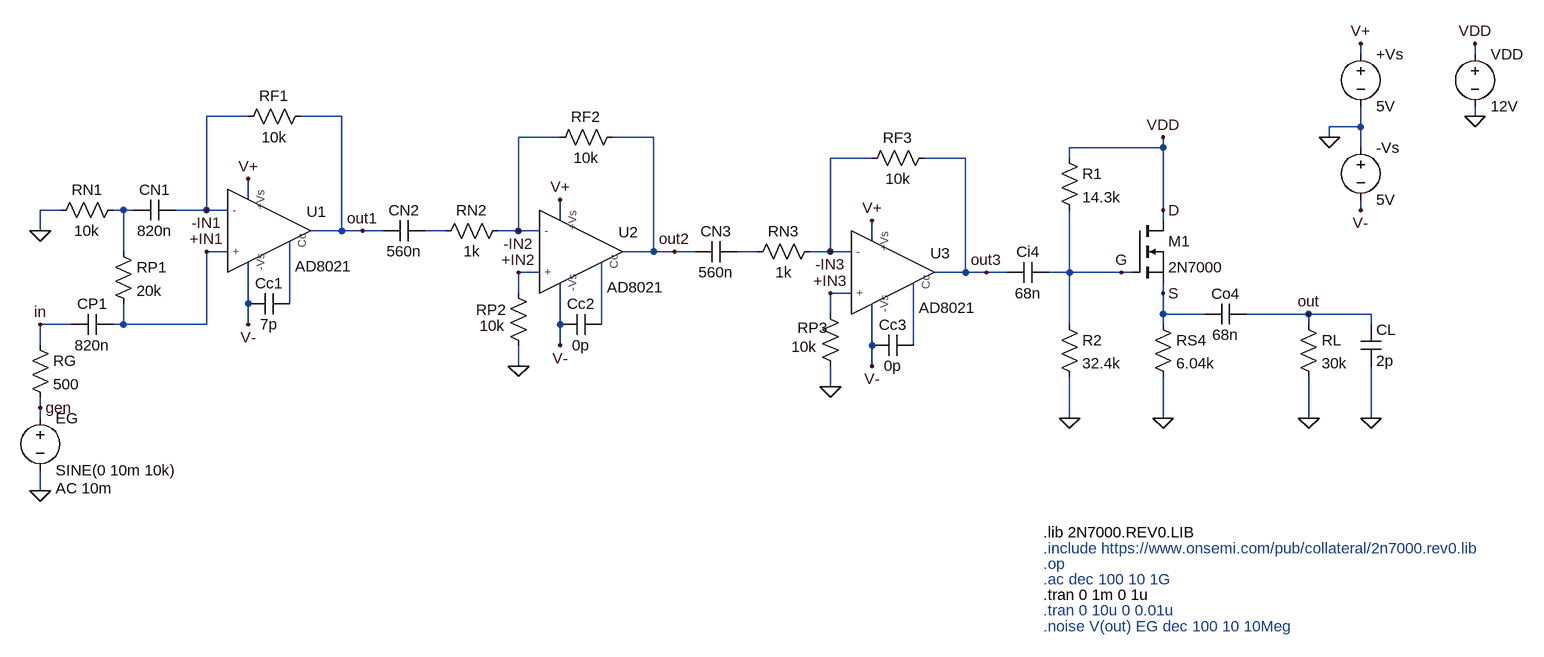
[diagram p0: schematic amplifier.asc]
amplifier.asc, the LTspice schematic file:
Version 4
SHEET 1 2700 800
WIRE 1904 -96 1904 -112
WIRE 2080 -96 2080 -112
WIRE 192 0 128 0
WIRE 336 0 272 0
WIRE 2080 0 2080 -16
WIRE 1904 16 1904 -16
WIRE 1904 16 1856 16
WIRE 672 32 608 32
WIRE 816 32 752 32
WIRE 1856 32 1856 16
WIRE 1600 48 1600 32
WIRE 1600 48 1456 48
WIRE 1904 48 1904 16
WIRE 1152 64 1088 64
WIRE 1296 64 1232 64
WIRE 1456 64 1456 48
WIRE 192 128 192 96
WIRE -96 144 -128 144
WIRE 0 144 -16 144
WIRE 16 144 0 144
WIRE 128 144 128 0
WIRE 128 144 80 144
WIRE 160 144 128 144
WIRE 1600 144 1600 48
WIRE 1904 144 1904 128
WIRE 672 160 672 128
WIRE 1600 160 1600 144
WIRE -128 176 -128 144
WIRE 336 176 336 0
WIRE 336 176 288 176
WIRE 368 176 336 176
WIRE 400 176 368 176
WIRE 496 176 464 176
WIRE 608 176 608 32
WIRE 608 176 576 176
WIRE 640 176 608 176
WIRE 1152 192 1152 160
WIRE 0 208 0 144
WIRE 160 208 128 208
WIRE 816 208 816 32
WIRE 816 208 768 208
WIRE 848 208 816 208
WIRE 880 208 848 208
WIRE 976 208 944 208
WIRE 1088 208 1088 64
WIRE 1088 208 1056 208
WIRE 1120 208 1088 208
WIRE 640 240 608 240
WIRE 1296 240 1296 64
WIRE 1296 240 1248 240
WIRE 1328 240 1296 240
WIRE 1360 240 1328 240
WIRE 1456 240 1456 144
WIRE 1456 240 1424 240
WIRE 1536 240 1456 240
WIRE 1552 240 1536 240
WIRE 608 272 608 240
WIRE 1120 272 1088 272
WIRE 1600 272 1600 256
WIRE 192 288 192 224
WIRE 256 288 256 192
WIRE 1088 304 1088 272
WIRE 1600 304 1600 272
WIRE 1664 304 1600 304
WIRE 1824 304 1728 304
WIRE 1920 304 1824 304
WIRE -80 320 -128 320
WIRE 0 320 0 288
WIRE 0 320 -16 320
WIRE 128 320 128 208
WIRE 128 320 0 320
WIRE 192 320 192 288
WIRE 672 320 672 256
WIRE 736 320 736 224
WIRE 1456 320 1456 240
WIRE 1600 320 1600 304
WIRE 1824 320 1824 304
WIRE 1920 320 1920 304
WIRE -128 352 -128 320
WIRE 672 352 672 320
WIRE 1152 352 1152 288
WIRE 1216 352 1216 256
WIRE 608 384 608 352
WIRE 1152 384 1152 352
WIRE 1088 416 1088 384
WIRE -128 448 -128 432
WIRE -128 464 -128 448
WIRE 1456 464 1456 400
WIRE 1600 464 1600 400
WIRE 1824 464 1824 400
WIRE 1920 464 1920 384
WIRE -128 576 -128 544
FLAG 1856 32 0
FLAG 1904 -112 V+
FLAG 192 96 V+
FLAG 192 320 V-
FLAG 1904 144 V-
FLAG -128 320 in
FLAG -128 176 0
FLAG -128 576 0
FLAG 128 144 -IN1
FLAG 128 208 +IN1
FLAG -128 448 gen
FLAG 672 128 V+
FLAG 672 352 V-
FLAG 608 176 -IN2
FLAG 608 240 +IN2
FLAG 608 384 0
FLAG 368 176 out1
FLAG 848 208 out2
FLAG 1152 160 V+
FLAG 1152 384 V-
FLAG 1328 240 out3
FLAG 1088 208 -IN3
FLAG 1088 272 +IN3
FLAG 1088 416 0
FLAG 2080 0 0
FLAG 2080 -112 VDD
FLAG 1600 32 VDD
FLAG 1456 464 0
FLAG 1600 464 0
FLAG 1824 464 0
FLAG 1920 464 0
FLAG 1824 304 out
FLAG 1600 144 D
FLAG 1536 240 G
FLAG 1600 272 S
SYMBOL AutoGenerated\\AD8021 224 176 R0
WINDOW 0 73 -14 Bottom 2
WINDOW 3 84 39 Top 2
SYMATTR InstName U1
SYMBOL voltage 1904 -112 R0
SYMATTR InstName +Vs
SYMATTR Value 5V
SYMBOL voltage 1904 32 R0
SYMATTR InstName -Vs
SYMATTR Value 5V
SYMBOL cap 256 272 R90
WINDOW 0 0 32 VBottom 2
WINDOW 3 32 32 VTop 2
SYMATTR InstName Cc1
SYMATTR Value 7p
SYMBOL res 288 -16 R90
WINDOW 0 0 56 VBottom 2
WINDOW 3 32 56 VTop 2
SYMATTR InstName RF1
SYMATTR Value 10k
SYMBOL res 0 128 R90
WINDOW 0 0 56 VBottom 2
WINDOW 3 32 56 VTop 2
SYMATTR InstName RN1
SYMATTR Value 10k
SYMBOL voltage -128 448 R0
WINDOW 123 24 124 Left 2
WINDOW 39 0 0 Left 0
SYMATTR Value2 AC 10m
SYMATTR InstName EG
SYMATTR Value SINE(0 10m 10k)
SYMBOL cap 80 128 R90
WINDOW 0 0 32 VBottom 2
WINDOW 3 32 32 VTop 2
SYMATTR InstName CN1
SYMATTR Value 820n
SYMBOL res -16 192 R0
SYMATTR InstName RP1
SYMATTR Value 20k
SYMBOL cap -16 304 R90
WINDOW 0 0 32 VBottom 2
WINDOW 3 32 32 VTop 2
SYMATTR InstName CP1
SYMATTR Value 820n
SYMBOL res -144 336 R0
SYMATTR InstName RG
SYMATTR Value 500
SYMBOL AutoGenerated\\AD8021 704 208 R0
WINDOW 0 73 -14 Bottom 2
WINDOW 3 84 39 Top 2
SYMATTR InstName U2
SYMBOL cap 736 304 R90
WINDOW 0 0 32 VBottom 2
WINDOW 3 32 32 VTop 2
SYMATTR InstName Cc2
SYMATTR Value 0p
SYMBOL res 768 16 R90
WINDOW 0 0 56 VBottom 2
WINDOW 3 32 56 VTop 2
SYMATTR InstName RF2
SYMATTR Value 10k
SYMBOL res 592 160 R90
WINDOW 0 0 56 VBottom 2
WINDOW 3 32 56 VTop 2
SYMATTR InstName RN2
SYMATTR Value 1k
SYMBOL cap 464 160 R90
WINDOW 0 0 32 VBottom 2
WINDOW 3 32 32 VTop 2
SYMATTR InstName CN2
SYMATTR Value 560n
SYMBOL res 592 256 R0
WINDOW 0 -49 41 Left 2
WINDOW 3 -44 66 Left 2
SYMATTR InstName RP2
SYMATTR Value 10k
SYMBOL AutoGenerated\\AD8021 1184 240 R0
WINDOW 0 73 -14 Bottom 2
WINDOW 3 84 39 Top 2
SYMATTR InstName U3
SYMBOL cap 1216 336 R90
WINDOW 0 0 32 VBottom 2
WINDOW 3 32 32 VTop 2
SYMATTR InstName Cc3
SYMATTR Value 0p
SYMBOL res 1248 48 R90
WINDOW 0 0 56 VBottom 2
WINDOW 3 32 56 VTop 2
SYMATTR InstName RF3
SYMATTR Value 10k
SYMBOL res 1072 192 R90
WINDOW 0 0 56 VBottom 2
WINDOW 3 32 56 VTop 2
SYMATTR InstName RN3
SYMATTR Value 1k
SYMBOL cap 944 192 R90
WINDOW 0 0 32 VBottom 2
WINDOW 3 32 32 VTop 2
SYMATTR InstName CN3
SYMATTR Value 560n
SYMBOL res 1072 288 R0
WINDOW 0 -35 37 Left 2
WINDOW 3 -44 66 Left 2
SYMATTR InstName RP3
SYMATTR Value 10k
SYMBOL nmos 1552 160 R0
SYMATTR InstName M1
SYMATTR Value 2N7000
SYMATTR Prefix X
SYMBOL voltage 2080 -112 R0
WINDOW 123 0 0 Left 0
WINDOW 39 0 0 Left 0
SYMATTR InstName VDD
SYMATTR Value 12V
SYMBOL res 1584 304 R0
SYMATTR InstName RS4
SYMATTR Value 6.04k
SYMBOL res 1440 304 R0
SYMATTR InstName R2
SYMATTR Value 32.4k
SYMBOL res 1440 48 R0
SYMATTR InstName R1
SYMATTR Value 14.3k
SYMBOL cap 1424 224 R90
WINDOW 0 0 32 VBottom 2
WINDOW 3 32 32 VTop 2
SYMATTR InstName Ci4
SYMATTR Value 68n
SYMBOL cap 1728 288 R90
WINDOW 0 0 32 VBottom 2
WINDOW 3 32 32 VTop 2
SYMATTR InstName Co4
SYMATTR Value 68n
SYMBOL res 1808 304 R0
SYMATTR InstName RL
SYMATTR Value 30k
SYMBOL cap 1904 320 R0
SYMATTR InstName CL
SYMATTR Value 2p
TEXT 1416 736 Left 2 !.tran 0 1m 0 1u
TEXT 1416 712 Left 2 ;.ac dec 100 10 1G
TEXT 1416 688 Left 2 ;.op
TEXT 1416 760 Left 2 ;.tran 0 10u 0 0.01u
TEXT 1416 640 Left 2 !.lib 2N7000.REV0.LIB
TEXT 1416 664 Left 2 ;.include https://www.onsemi.com/pub/collateral/2n7000.rev0.lib
TEXT 1416 784 Left 2 ;.noise V(out) EG dec 100 10 10Meg

The netlist it stands for:
* amplifier.asc
XU1 +IN1 -IN1 V+ V- out1 N004 AD8021  ; pins + - +Vs -Vs OUT Cc
V§+Vs V+ 0 5V
V§-Vs 0 V- 5V
Cc1 N004 V- 7p
RF1 out1 -IN1 10k
RN1 N001 0 10k
V§EG gen 0 SINE(0 10m 10k) AC 10m
CN1 -IN1 N001 820n
RP1 N001 +IN1 20k
CP1 +IN1 in 820n
RG in gen 500
XU2 +IN2 -IN2 V+ V- out2 N005 AD8021  ; pins + - +Vs -Vs OUT Cc
Cc2 N005 V- 0p
RF2 out2 -IN2 10k
RN2 -IN2 N002 1k
CN2 N002 out1 560n
RP2 +IN2 0 10k
XU3 +IN3 -IN3 V+ V- out3 N006 AD8021  ; pins + - +Vs -Vs OUT Cc
Cc3 N006 V- 0p
RF3 out3 -IN3 10k
RN3 -IN3 N003 1k
CN3 N003 out2 560n
RP3 +IN3 0 10k
XM1 D G S 2N7000  ; pins D G S
VDD D 0 12V
RS4 S 0 6.04k
R2 G 0 32.4k
R1 D G 14.3k
Ci4 G out3 68n
Co4 out S 68n
RL out 0 30k
CL out 0 2p
.tran 0 1m 0 1u
* .ac dec 100 10 1G
* .op
* .tran 0 10u 0 0.01u
.lib 2N7000.REV0.LIB
* .include https://www.onsemi.com/pub/collateral/2n7000.rev0.lib
* .noise V(out) EG dec 100 10 10Meg
.lib Z:\home\pesho\data\Electronics\asht-kr\simulations\ad8021.cir
.backanno
.end